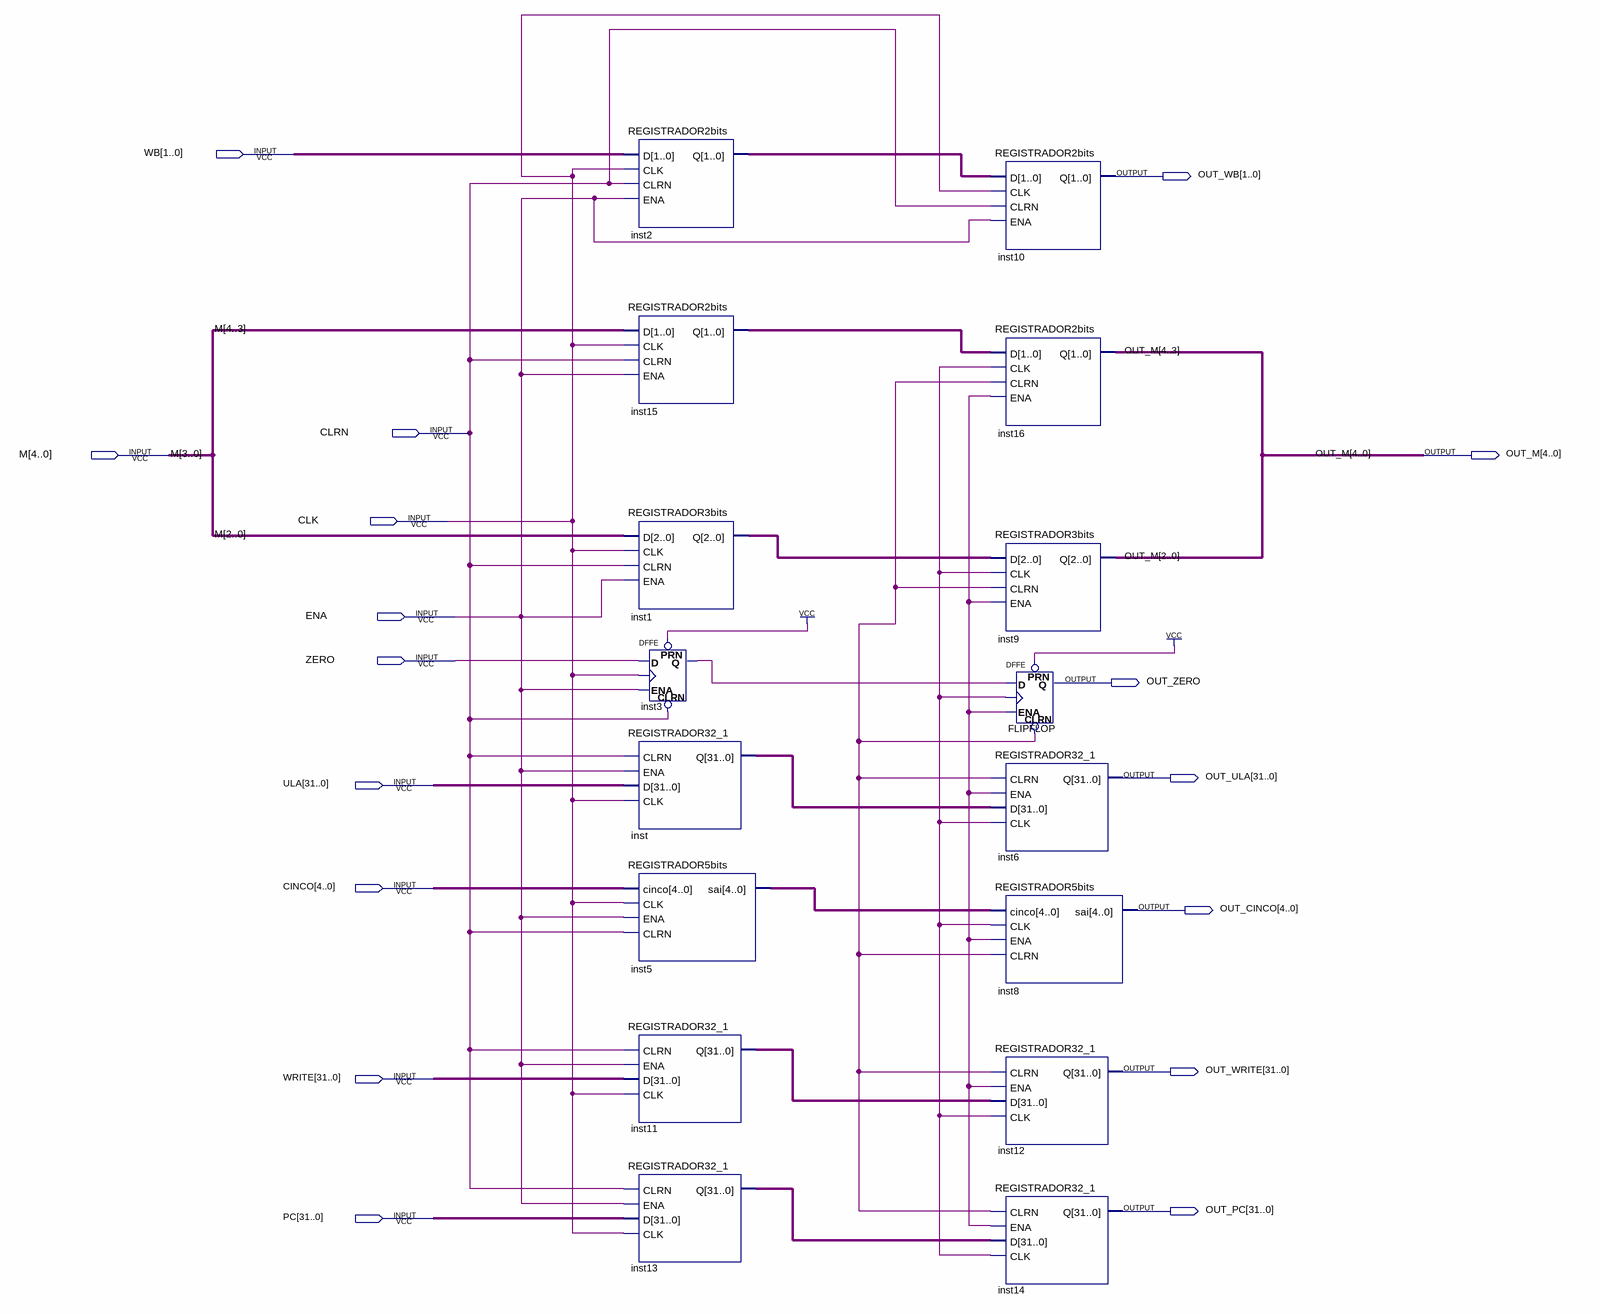
[diagram p0: schematic sheet]
// Quartus schematic EX_MEM.bdf as structural Verilog: 16 symbols, 17 pins
module EX_MEM (
  input  [1:0] WB,
  input  CLRN,
  input  [4:0] M,
  input  CLK,
  input  ENA,
  input  ZERO,
  input  [31:0] ULA,
  input  [4:0] CINCO,
  input  [31:0] WRITE,
  input  [31:0] PC,
  output [1:0] OUT_WB,
  output [4:0] OUT_M,
  output OUT_ZERO,
  output [31:0] OUT_ULA,
  output [4:0] OUT_CINCO,
  output [31:0] OUT_WRITE,
  output [31:0] OUT_PC
);

  wire inst3_q, undriven, undriven_2, undriven_3;
  wire [1:0] inst2_q, inst15_q;
  wire [2:0] inst1_q;
  wire [4:0] inst5_sai;
  wire [31:0] inst11_q, inst13_q, inst_q;

  REGISTRADOR2bits inst2 (.D(WB), .CLK(CLK), .CLRN(CLRN), .ENA(ENA), .Q(inst2_q));
  REGISTRADOR2bits inst15 (.D(M[4:3]), .CLK(CLK), .CLRN(CLRN), .ENA(ENA), .Q(inst15_q));
  REGISTRADOR3bits inst1 (.D(M[2:0]), .CLK(CLK), .CLRN(CLRN), .ENA(ENA), .Q(inst1_q));
  DFFE inst3 (.PRN(1'b1), .CLRN(CLRN), .D(ZERO), .CLK(CLK), .ENA(ENA), .Q(inst3_q));
  REGISTRADOR32_1 inst (.CLRN(CLRN), .ENA(ENA), .D(ULA), .CLK(CLK), .Q(inst_q));
  REGISTRADOR5bits inst5 (.cinco(CINCO), .CLK(CLK), .ENA(ENA), .CLRN(CLRN), .sai(inst5_sai));
  REGISTRADOR32_1 inst11 (.CLRN(CLRN), .ENA(ENA), .D(WRITE), .CLK(CLK), .Q(inst11_q));
  REGISTRADOR32_1 inst13 (.CLRN(CLRN), .ENA(ENA), .D(PC), .CLK(CLK), .Q(inst13_q));
  REGISTRADOR2bits inst10 (.D(inst2_q), .CLK(CLK), .CLRN(CLRN), .ENA(ENA), .Q(OUT_WB));
  REGISTRADOR2bits inst16 (.D(inst15_q), .CLK(undriven), .CLRN(undriven_3), .ENA(undriven_2), .Q(OUT_M[4:3]));
  REGISTRADOR3bits inst9 (.D(inst1_q), .CLK(undriven), .CLRN(undriven_3), .ENA(undriven_2), .Q(OUT_M[2:0]));
  REGISTRADOR32_1 inst6 (.CLRN(undriven_3), .ENA(undriven_2), .D(inst_q), .CLK(undriven), .Q(OUT_ULA));
  REGISTRADOR5bits inst8 (.cinco(inst5_sai), .CLK(undriven), .ENA(undriven_2), .CLRN(undriven_3), .sai(OUT_CINCO));
  REGISTRADOR32_1 inst12 (.CLRN(undriven_3), .ENA(undriven_2), .D(inst11_q), .CLK(undriven), .Q(OUT_WRITE));
  REGISTRADOR32_1 inst14 (.CLRN(undriven_3), .ENA(undriven_2), .D(inst13_q), .CLK(undriven), .Q(OUT_PC));
  DFFE FLIPFLOP (.PRN(1'b1), .CLRN(undriven_3), .D(inst3_q), .CLK(undriven), .ENA(undriven_2), .Q(OUT_ZERO));
endmodule
